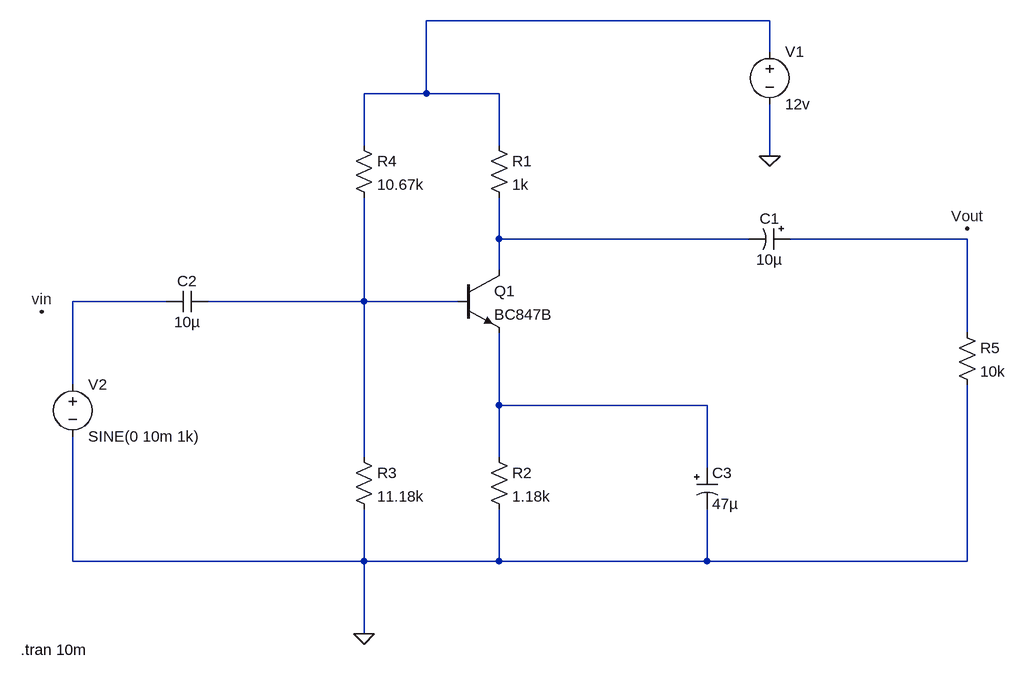
[diagram p0: schematic EXP_common emitter amplifier output.asc]
EXP_common emitter amplifier output.asc, the LTspice schematic file:
Version 4
SHEET 1 1012 724
WIRE 640 -336 112 -336
WIRE 640 -288 640 -336
WIRE 112 -224 112 -336
WIRE 112 -224 16 -224
WIRE 224 -224 112 -224
WIRE 16 -144 16 -224
WIRE 224 -144 224 -224
WIRE 640 -128 640 -208
WIRE 224 0 224 -64
WIRE 608 0 224 0
WIRE 944 0 672 0
WIRE 224 48 224 0
WIRE -288 96 -432 96
WIRE 16 96 16 -64
WIRE 16 96 -224 96
WIRE 160 96 16 96
WIRE 944 144 944 0
WIRE -432 224 -432 96
WIRE 224 256 224 144
WIRE 544 256 224 256
WIRE 16 336 16 96
WIRE 224 336 224 256
WIRE 544 352 544 256
WIRE -432 496 -432 304
WIRE 16 496 16 416
WIRE 16 496 -432 496
WIRE 224 496 224 416
WIRE 224 496 16 496
WIRE 544 496 544 416
WIRE 544 496 224 496
WIRE 944 496 944 224
WIRE 944 496 544 496
WIRE 16 608 16 496
FLAG 16 608 0
FLAG 640 -128 0
FLAG -480 112 vin
FLAG 944 -16 Vout
SYMBOL npn 160 48 R0
SYMATTR InstName Q1
SYMATTR Value BC847B
SYMBOL res 208 -160 R0
SYMATTR InstName R1
SYMATTR Value 1k
SYMBOL res 208 320 R0
SYMATTR InstName R2
SYMATTR Value 1.18k
SYMBOL res 0 320 R0
SYMATTR InstName R3
SYMATTR Value 11.18k
SYMBOL res 0 -160 R0
SYMATTR InstName R4
SYMATTR Value 10.67k
SYMBOL polcap 672 -16 R90
WINDOW 0 0 32 VBottom 2
WINDOW 3 32 32 VTop 2
SYMATTR InstName C1
SYMATTR Value 10µ
SYMATTR Description Capacitor
SYMATTR Type cap
SYMATTR SpiceLine V=6.3 Irms=0 Rser=4 Lser=0 mfg="AVX" pn="TAJA106M006" type="Tantalum"
SYMBOL cap -224 80 R90
WINDOW 0 0 32 VBottom 2
WINDOW 3 32 32 VTop 2
SYMATTR InstName C2
SYMATTR Value 10µ
SYMATTR SpiceLine V=16 Irms=11 Rser=0.00378043 Lser=0 mfg="KEMET" pn="C0805C106K4PAC" type="X5R"
SYMBOL voltage 640 -304 R0
WINDOW 123 0 0 Left 0
WINDOW 39 0 0 Left 0
SYMATTR InstName V1
SYMATTR Value 12v
SYMBOL voltage -432 208 R0
WINDOW 123 0 0 Left 0
WINDOW 39 0 0 Left 0
SYMATTR InstName V2
SYMATTR Value SINE(0 10m 1k)
SYMBOL polcap 528 352 R0
WINDOW 3 24 56 Left 2
SYMATTR Value 47µ
SYMATTR InstName C3
SYMATTR Description Capacitor
SYMATTR Type cap
SYMATTR SpiceLine V=4 Irms=0 Rser=2.4 Lser=0 mfg="AVX" pn="TAJB476M004" type="Tantalum"
SYMBOL res 928 128 R0
SYMATTR InstName R5
SYMATTR Value 10k
TEXT -512 632 Left 2 !.tran 10m

The netlist it stands for:
* EXP_common emitter amplifier output.asc
Q1 N002 N005 N006 0 BC847B
R1 N001 N002 1k
R2 N006 0 1.18k
R3 N005 0 11.18k
R4 N001 N005 10.67k
C1 N003 N002 10µ V=6.3 Irms=0 Rser=4 Lser=0 mfg="AVX" pn="TAJA106M006" type="Tantalum"
C2 N005 N004 10µ V=16 Irms=11 Rser=0.00378043 Lser=0 mfg="KEMET" pn="C0805C106K4PAC" type="X5R"
V1 N001 0 12v
V2 N004 0 SINE(0 10m 1k)
C3 N006 0 47µ V=4 Irms=0 Rser=2.4 Lser=0 mfg="AVX" pn="TAJB476M004" type="Tantalum"
R5 N003 0 10k
.model NPN NPN
.model PNP PNP
.lib standard.bjt
.tran 10m
.backanno
.end